# EAGLE schematic Schaltplan (EAGLE 6.4)
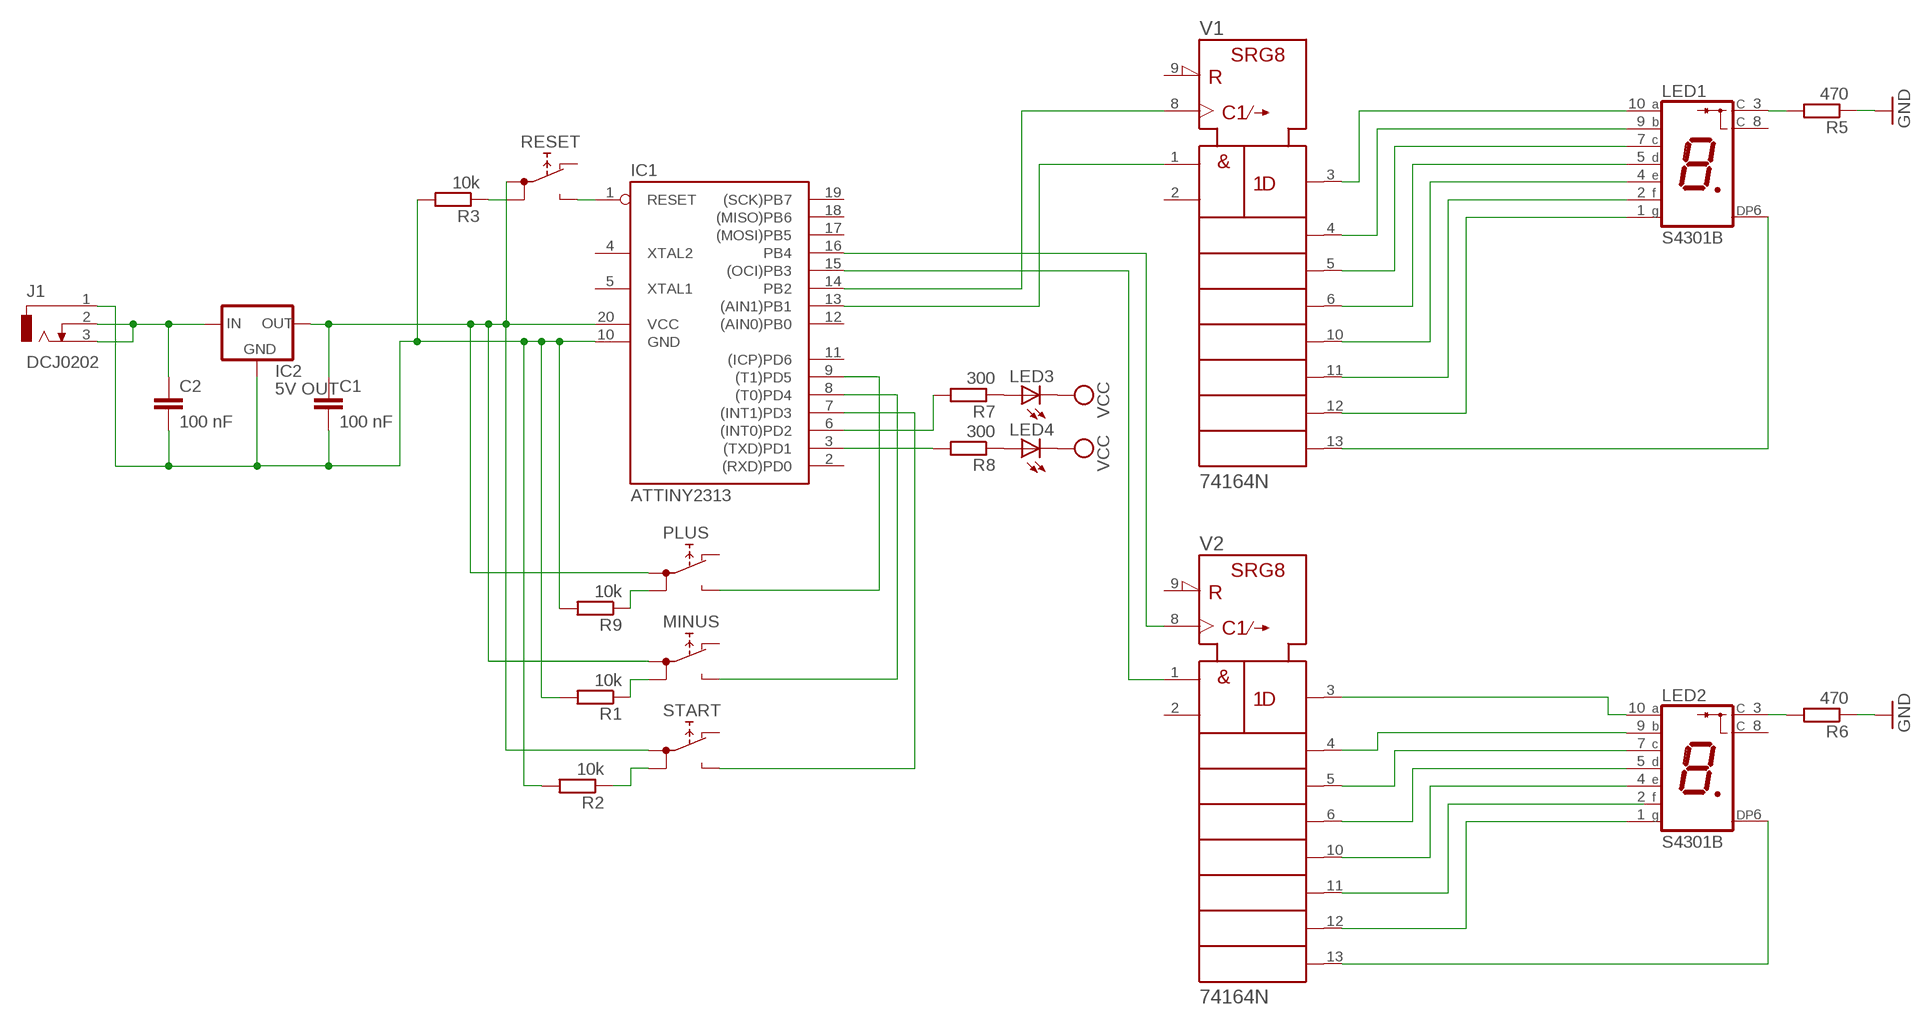
[diagram p0: schematic, sheet 1]

## Parts
C1  100 nF  C-EU025-024X044  [C025-024X044]
C2  100 nF  C-EU025-024X044  [C025-024X044]
IC1  ATTINY2313  AT90S2313P  [DIL20]
IC2  5V OUT  78MXXL  [78MXXL]
J1  DCJ0202  [DCJ0202]
LED1  S4301B  [S4301B]
LED2  S4301B  [S4301B]
LED3  LED3MM  [LED3MM]
LED4  LED3MM  [LED3MM]
MINUS  5501  [5501]
PLUS  5501  [5501]
R1  10k  R-EU_0204/7  [0204/7]
R2  10k  R-EU_0204/7  [0204/7]
R3  10k  R-EU_0204/7  [0204/7]
R5  470  R-EU_0204/7  [0204/7]
R6  470  R-EU_0204/7  [0204/7]
R7  300  R-EU_0204/7  [0204/7]
R8  300  R-EU_0204/7  [0204/7]
R9  10k  R-EU_0204/7  [0204/7]
RESET  5501  [5501]
START  5501  [5501]
V1  74164N  [DIL14]
V2  74164N  [DIL14]

## Nets
GND: R5.1 R6.1
N$1: LED1.10(A) V1.3(QA)
N$2: LED1.9(B) V1.4(QB)
N$3: LED1.7(C) V1.5(QC)
N$4: LED1.5(D) V1.6(QD)
N$5: LED1.4(E) V1.10(QE)
N$6: LED1.2(F) V1.11(QF)
N$7: LED1.1(G) V1.12(QG)
N$8: LED1.6(DP) V1.13(QH)
N$9: IC1.13((AIN1)PB1) V1.1(A)
N$10: IC1.14(PB2) V1.8(CLK)
N$11: IC1.15((OCI)PB3) V2.1(A)
N$12: IC1.16(PB4) V2.8(CLK)
N$13: LED2.10(A) V2.3(QA)
N$14: LED2.9(B) V2.4(QB)
N$15: LED2.7(C) V2.5(QC)
N$16: LED2.5(D) V2.6(QD)
N$17: LED2.4(E) V2.10(QE)
N$18: V2.11(QF)
N$19: LED2.1(G) V2.12(QG)
N$20: LED2.6(DP) V2.13(QH)
N$21: MINUS.1B R1.1
N$22: IC1.9((T1)PD5) PLUS.NO
N$23: LED3.A R7.1
N$24: R2.1 START.1B
N$25: IC1.8((T0)PD4) MINUS.NO
N$26: PLUS.1B R9.1
N$27: IC1.7((INT1)PD3) START.NO
N$28: IC1.1(RESET) RESET.NO
N$29: LED4.A R8.1
N$30: R3.1 RESET.1B
N$31: C2.1 IC2.IN J1.2 J1.3
N$32: C1.2 C2.2 IC1.10(GND) IC2.GND J1.1 R1.2 R2.2 R3.2 R9.2
N$33: C1.1 IC1.20(VCC) IC2.OUT MINUS.1A PLUS.1A RESET.1A START.1A
N$34: IC1.3((TXD)PD1) R8.2
N$35: IC1.6((INT0)PD2) R7.2
N$36: LED1.3(C) R5.2
N$37: LED2.3(C) R6.2
VCC: LED3.K(C) LED4.K(C)
Unconnected: IC1.2((RXD)PD0) IC1.4(XTAL2) IC1.5(XTAL1) IC1.11((ICP)PD6) IC1.12((AIN0)PB0) IC1.17((MOSI)PB5) IC1.18((MISO)PB6) IC1.19((SCK)PB7) LED1.8(C) LED2.2(F) LED2.8(C) MINUS.NC PLUS.NC RESET.NC START.NC V1.2(B) V1.9(!CLR) V2.2(B) V2.9(!CLR)

## Power pins joined to a net without a drawn wire
+UB: V1.14(+UB) V2.14(+UB)
-UB: V1.7(-UB) V2.7(-UB)

## Library data of the parts
C1 C2 = rcl:C-EU: CAPACITOR, European symbol
IC1 = atmel:AT90S2313: MICROCONTROLLER 2 Kbytes FLASH 128 bytes SRAM 128 bytes EEPROM UART; OC_FARNELL: unknown; OC_NEWARK: unknown
IC2 = v-reg:78MXXL: VOLTAGE REGULATOR
J1 = con-jack:DCJ0202: DC POWER JACK Source: DCJ0202.pdf; OC_FARNELL: unknown; OC_NEWARK: unknown
LED1 LED2 = led-7-segment:S4301B: Single Digit Seven-Segment Display (cathode common) Source: LITEON .. S4301B.pdf; OC_FARNELL: unknown; OC_NEWARK: unknown
LED3 LED4 = led:LED: LED OSRAM: - CHIPLED LG R971, LG N971, LY N971, LG Q971, LY Q971, LO R971, LY R971 LH N974, LH R974 LS Q976, LO Q976, LY Q976 LO Q996 - Hyper CHIPLED LW Q18S LB Q993, LB Q99A, LB R99A - SideLED LS A670, LO A670, LY A670, LG A670, LP A670 LB A673, LV A673, LT A673, LW A673 LH A674 LY A675 LS A676, LA A676, LO A676, LY A676, LW A676 LS A679, LY A679, LG A679 - Hyper Micro SIDELED® LS Y876, LA Y876, LO Y876, LY Y876 LT Y87S - SmartLED LW L88C, LW L88S LB L89C, LB L89S, LG L890 LS L89K, LO L89K, LY L89K LS L896, LA L896, LO L896, LY L896 - TOPLED LS T670, LO T670, LY T670, LG T670, LP T670 LSG T670, LSP T670, LSY T670, LOP T670, LYG T670 LG T671, LOG T671, LSG T671 LB T673, LV T673, LT T673, LW T673 LH T674 LS T676, LA T676, LO T676, LY T676, LB T676, LH T676, LSB T676, LW T676 LB T67C, LV T67C, LT T67C, LS T67K, LO T67K, LY T67K, LW E67C LS E67B, LA E67B, LO E67B, LY E67B, LB E67C, LV E67C, LT E67C LW T67C LS T679, LY T679, LG T679 LS T770, LO T770, LY T770, LG T770, LP T770 LB T773, LV T773, LT T773, LW T773 LH T774 LS E675, LA E675, LY E675, LS T675 LS T776, LA T776, LO T776, LY T776, LB T776 LHGB T686 LT T68C, LB T68C - Hyper Mini TOPLED® LB M676 - Mini TOPLED Santana® LG M470 LS M47K, LO M47K, LY M47K Source: http://www.osram.convergy.de LUXEON: - LUMILED® LXK2-PW12-R00, LXK2-PW12-S00, LXK2-PW14-U00, LXK2-PW14-V00 LXK2-PM12-R00, LXK2-PM12-S00, LXK2-PM14-U00 LXK2-PE12-Q00, LXK2-PE12-R00, LXK2-PE12-S00, LXK2-PE14-T00, LXK2-PE14-U00 LXK2-PB12-K00, LXK2-PB12-L00, LXK2-PB12-M00, LXK2-PB14-N00, LXK2-PB14-P00, LXK2-PB14-Q00 LXK2-PR12-L00, LXK2-PR12-M00, LXK2-PR14-Q00, LXK2-PR14-R00 LXK2-PD12-Q00, LXK2-PD12-R00, LXK2-PD12-S00 LXK2-PH12-R00, LXK2-PH12-S00 LXK2-PL12-P00, LXK2-PL12-Q00, LXK2-PL12-R00 Source: www.luxeon.com KINGBRIGHT: KA-3528ASYC Source: www.kingbright.com
MINUS PLUS RESET START = switch:55?: PUSHBUTTON SERIES 5500 SWITCHES Source: www.e-switch.com .. 5500.pdf
R1-R3 R5-R9 = rcl:R-EU_: RESISTOR, European symbol
V1 V2 = 74ttl-din:74*164: 8-bit parallel out SHIFT REGISTER